# EAGLE design DashHubV6 (EAGLE 9.6.2)
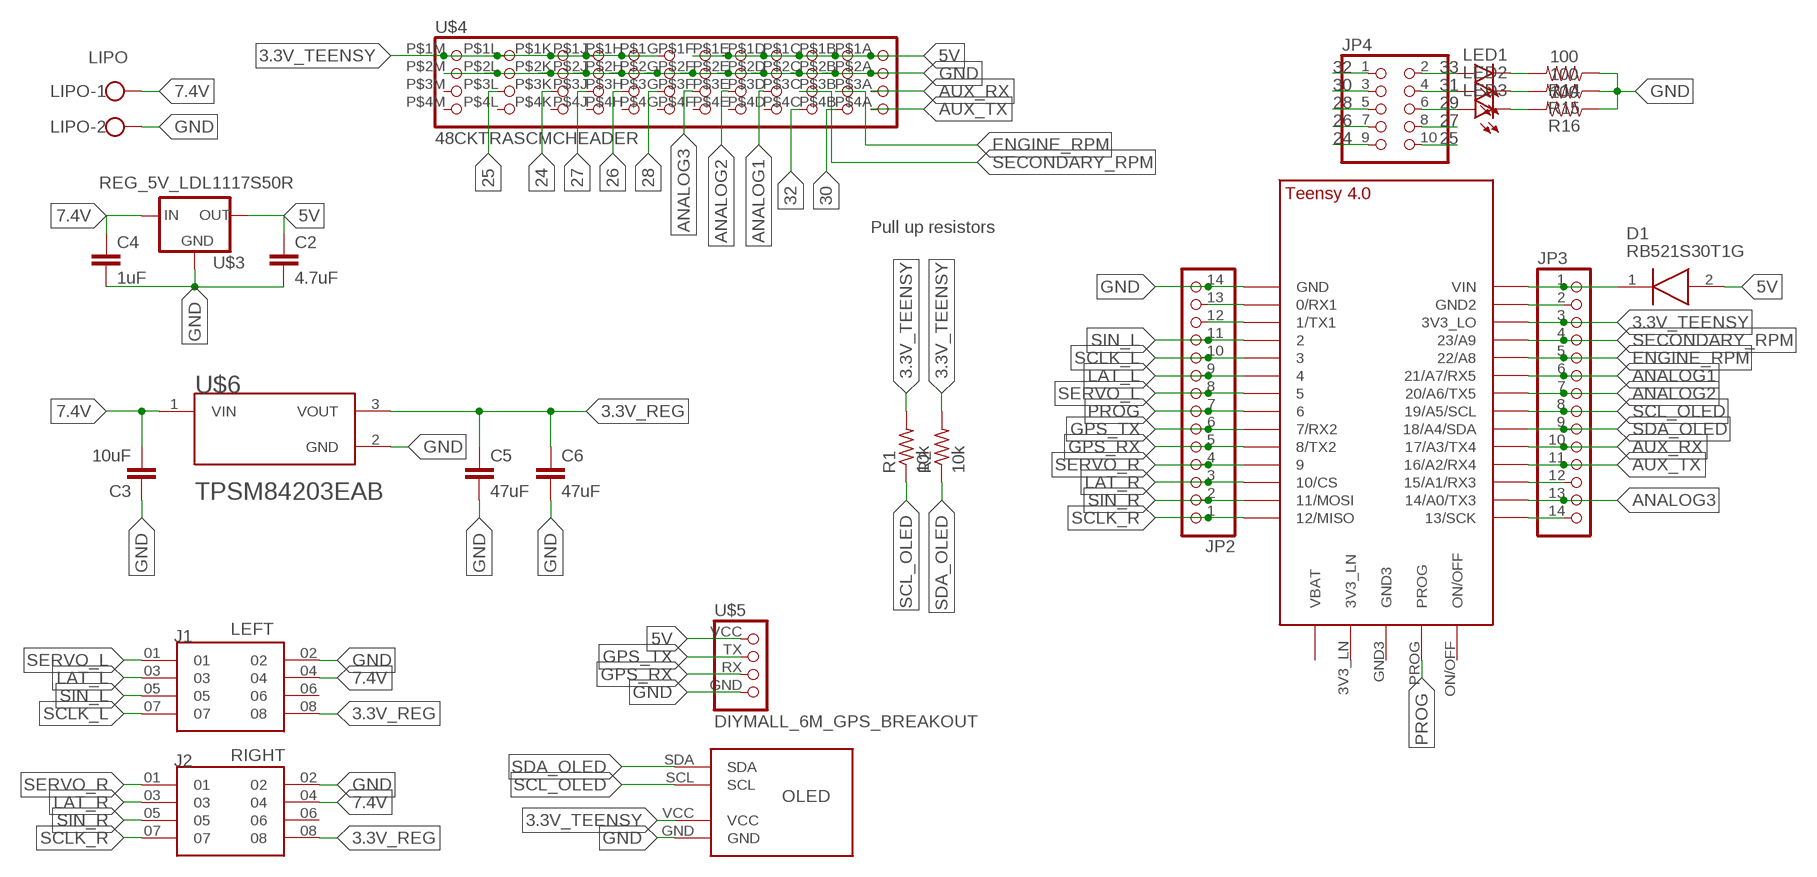
[diagram p0: schematic, sheet 1]

## Parts
C2  4.7uF  CAP_SMDC0603  [C0603]
C3  10uF  CAP_SMDC1206  [C1206]
C4  1uF  CAP_SMDC1206  [C1206]
C5  47uF  CAP_SMDC1206  [C1206]
C6  47uF  CAP_SMDC1206  [C1206]
D1  RB521S30T1G  [SODFL1608X70N]
J1  LEFT  ESW-104-23-L-D  [SAMTEC_ESW-104-23-L-D]
J2  RIGHT  ESW-104-23-L-D  [SAMTEC_ESW-104-23-L-D]
JP2  PINHD-1X14  [1X14]
JP3  PINHD-1X14  [1X14]
JP4  PINHD-2X5  [2X05]
LED1  LEDCHIPLED_1206  [CHIPLED_1206]
LED2  LEDCHIPLED_1206  [CHIPLED_1206]
LED3  LEDCHIPLED_1206  [CHIPLED_1206]
LIPO  LIPO  W237-102  [W237-102]
R1  10k  RES_SMDR0603  [R0603]
R2  10k  RES_SMDR0603  [R0603]
R14  100  RESISTORAXIAL-0.3  [AXIAL-0.3]
R15  100  RESISTORAXIAL-0.3  [AXIAL-0.3]
R16  100  RESISTORAXIAL-0.3  [AXIAL-0.3]
U$1  TEENSY_4.0-BASIC  [TEENSY_4.0-BASIC]
U$2  OLED_SSD1306  [OLED_SSD1306]
U$3  REG_5V_LDL1117S50R  [SOT230P700X180-4N]
U$4  48CKTRASCMCHEADER  [48CKTRASCMCHEADER]
U$5  DIYMALL_6M_GPS_BREAKOUT  [DIYMALL_6M_GPS_BREAKOUT]
U$6  TPSM84205EAB  [TPSM84205EAB]

## Nets
3.3V_REG: C5.1 C6.1 J1.08 J2.08 U$6.3(VOUT)
3.3V_TEENSY: JP3.3 R1.2 R2.2 U$1.3V3_LO U$2.VCC U$4.P$1G(1G) U$4.P$1H(1H) U$4.P$1J(1J) U$4.P$1K(1K) U$4.P$1L(1L) U$4.P$1M(1M)
5V: C2.1 D1.2(A) U$3.2(OUT) U$3.4(OUT) U$4.P$1A(1A) U$4.P$1B(1B) U$4.P$1C(1C) U$4.P$1D(1D) U$4.P$1E(1E) U$4.P$1F(1F) U$5.VCC
7.4V: C3.2 C4.1 J1.04 J2.04 LIPO.1 U$3.3(IN) U$6.1(VIN)
24: JP4.9 U$4.P$3K(3K)
25: JP4.10 U$4.P$3L(3L)
26: JP4.7 U$4.P$3H(3H)
27: JP4.8 U$4.P$3J(3J)
28: JP4.5 U$4.P$3G(3G)
29: JP4.6 LED3.A
30: JP4.3 U$4.P$4B(4B)
31: JP4.4 LED2.A
32: JP4.1 U$4.P$4C(4C)
33: JP4.2 LED1.A
ANALOG1: JP3.6 U$1.21/A7(21/A7/RX5) U$4.P$3D(3D)
ANALOG2: JP3.7 U$1.20/A6(20/A6/TX5) U$4.P$3E(3E)
ANALOG3: JP3.13 U$1.14/A0(14/A0/TX3) U$4.P$3F(3F)
AUX_RX: JP3.10 U$1.17/A3(17/A3/TX4) U$4.P$3A(3A)
AUX_TX: JP3.11 U$1.16/A2(16/A2/RX4) U$4.P$4A(4A)
CURR_SENSE: JP3.12 U$1.15/A1(15/A1/RX3)
ENGINE_RPM: JP3.5 U$1.22/A8 U$4.P$3B(3B)
GND: C2.2 C3.1 C4.2 C5.2 C6.2 J1.02 J2.02 JP2.14 LIPO.2 R14.P$1 R15.P$1 R16.P$1 U$1.GND U$2.GND U$3.1(GND) U$4.P$2A(2A) U$4.P$2B(2B) U$4.P$2C(2C) U$4.P$2D(2D) U$4.P$2E(2E) U$4.P$2F(2F) U$4.P$2G(2G) U$4.P$2H(2H) U$4.P$2J(2J) U$4.P$2K(2K) U$4.P$2L(2L) U$4.P$2M(2M) U$5.GND U$6.2(GND)
GND2: JP3.2 U$1.GND2
GPS_RX: JP2.5 U$1.8(8/TX2) U$5.RX
GPS_TX: JP2.6 U$1.7(7/RX2) U$5.TX
LAT_L: J1.03 JP2.9 U$1.4/CANRX
LAT_R: J2.03 JP2.3 U$1.10/CS
N$2: D1.1(K) JP3.1 U$1.VIN
N$11: LED1.C R14.P$2
N$12: LED2.C R15.P$2
N$13: LED3.C R16.P$2
PROG: JP2.7 U$1.6 U$1.PROG
SCL_OLED: JP3.8 R1.1 U$1.19/A5/SCL U$2.SCL
SCLK_D: JP3.14 U$1.13/SCK
SCLK_L: J1.07 JP2.10 U$1.3/CANTX
SCLK_R: J2.07 JP2.1 U$1.12/MISO
SDA_OLED: JP3.9 R2.1 U$1.18/A4/SDA U$2.SDA
SECONDARY_RPM: JP3.4 U$1.23/A9 U$4.P$3C(3C)
SERVO_L: J1.01 JP2.8 U$1.5
SERVO_R: J2.01 JP2.4 U$1.9/CS
SIN_L: J1.05 JP2.11 U$1.2
SIN_R: J2.05 JP2.2 U$1.11/MOSI
XBEE_RX: JP2.12 U$1.1/TX(1/TX1)
XBEE_TX: JP2.13 U$1.0/RX(0/RX1)
Unconnected: J1.06 J2.06 U$1.3V3_LN U$1.GND3 U$1.ON/OFF U$1.VBAT\(VBAT) U$4.P$3M(3M) U$4.P$4D(4D) U$4.P$4E(4E) U$4.P$4F(4F) U$4.P$4G(4G) U$4.P$4H(4H) U$4.P$4J(4J) U$4.P$4K(4K) U$4.P$4L(4L) U$4.P$4M(4M)

## Notes on the sheet
- Pull up resistors

## Library data of the parts
C2-C6 = GTOR - Passive Components:CAP_SMD: CAPACITOR, European symbol; SPICEPREFIX: C
D1 = RB521S30T1G:RB521S30T1G: Schottky Barrier Diode Source: Datasheet <http://www.onsemi.com/pub/Collateral/RB521S30T1-D.PDF>; ARROW_PART_NUMBER: RB521S30T1G; ARROW_PRICE-STOCK: https://www.arrow.com/en/products/rb521s30t1g/on-semiconductor; DESCRIPTION: Schottky Barrier Diode; HEIGHT: 0.7mm; MANUFACTURER_NAME: ON Semiconductor; MANUFACTURER_PART_NUMBER: RB521S30T1G; MOUSER_PART_NUMBER: 863-RB521S30T1G; MOUSER_PRICE-STOCK: https://www.mouser.co.uk/ProductDetail/ON-Semiconductor/RB521S30T1G?qs=xZq1yRCsb1eKFKS8TVH%2Fqg%3D%3D
J1 J2 = ESW-104-23-L-D:ESW-104-23-L-D; MANUFACTURER: Samtec Inc.; PARTREV: R; STANDARD: Manufacturer Recommendations
JP2 JP3 = pinhead:PINHD-1X14: PIN HEADER
JP4 = pinhead:PINHD-2X5: PIN HEADER
LED1-LED3 = led:LED: LED OSRAM: - CHIPLED LG R971, LG N971, LY N971, LG Q971, LY Q971, LO R971, LY R971 LH N974, LH R974 LS Q976, LO Q976, LY Q976 LO Q996 - Hyper CHIPLED LW Q18S LB Q993, LB Q99A, LB R99A - SideLED LS A670, LO A670, LY A670, LG A670, LP A670 LB A673, LV A673, LT A673, LW A673 LH A674 LY A675 LS A676, LA A676, LO A676, LY A676, LW A676 LS A679, LY A679, LG A679 - Hyper Micro SIDELED® LS Y876, LA Y876, LO Y876, LY Y876 LT Y87S - SmartLED LW L88C, LW L88S LB L89C, LB L89S, LG L890 LS L89K, LO L89K, LY L89K LS L896, LA L896, LO L896, LY L896 - TOPLED LS T670, LO T670, LY T670, LG T670, LP T670 LSG T670, LSP T670, LSY T670, LOP T670, LYG T670 LG T671, LOG T671, LSG T671 LB T673, LV T673, LT T673, LW T673 LH T674 LS T676, LA T676, LO T676, LY T676, LB T676, LH T676, LSB T676, LW T676 LB T67C, LV T67C, LT T67C, LS T67K, LO T67K, LY T67K, LW E67C LS E67B, LA E67B, LO E67B, LY E67B, LB E67C, LV E67C, LT E67C LW T67C LS T679, LY T679, LG T679 LS T770, LO T770, LY T770, LG T770, LP T770 LB T773, LV T773, LT T773, LW T773 LH T774 LS E675, LA E675, LY E675, LS T675 LS T776, LA T776, LO T776, LY T776, LB T776 LHGB T686 LT T68C, LB T68C - Hyper Mini TOPLED® LB M676 - Mini TOPLED Santana® LG M470 LS M47K, LO M47K, LY M47K Source: http://www.osram.convergy.de LUXEON: - LUMILED® LXK2-PW12-R00, LXK2-PW12-S00, LXK2-PW14-U00, LXK2-PW14-V00 LXK2-PM12-R00, LXK2-PM12-S00, LXK2-PM14-U00 LXK2-PE12-Q00, LXK2-PE12-R00, LXK2-PE12-S00, LXK2-PE14-T00, LXK2-PE14-U00 LXK2-PB12-K00, LXK2-PB12-L00, LXK2-PB12-M00, LXK2-PB14-N00, LXK2-PB14-P00, LXK2-PB14-Q00 LXK2-PR12-L00, LXK2-PR12-M00, LXK2-PR14-Q00, LXK2-PR14-R00 LXK2-PD12-Q00, LXK2-PD12-R00, LXK2-PD12-S00 LXK2-PH12-R00, LXK2-PH12-S00 LXK2-PL12-P00, LXK2-PL12-Q00, LXK2-PL12-R00 Source: www.luxeon.com KINGBRIGHT: KA-3528ASYC Source: www.kingbright.com
LIPO = con-wago-500:W237-102: WAGO SCREW CLAMP; MPN: 237-102; OC_FARNELL: unknown; OC_NEWARK: 70K9898
R1 R2 = GTOR - Passive Components:RES_SMD: RESISTOR, American symbol; SPICEPREFIX: R
R14-R16 = SparkFun-Resistors:RESISTOR: Generic Resistor Package
U$1 = Teensy-4.0:TEENSY_4.0-BASIC
U$2 = GTOR - Breakout Boards:OLED_SSD1306
U$3 = GTOR - Active Components:REG_5V_LDL1117S50R
U$4 = GTOR - Connectors:48CKTRASCMCHEADER
U$5 = GTOR - Breakout Boards:DIYMALL_6M_GPS_BREAKOUT
U$6 = GTOR - Active Components:TPSM84205EAB

## Board
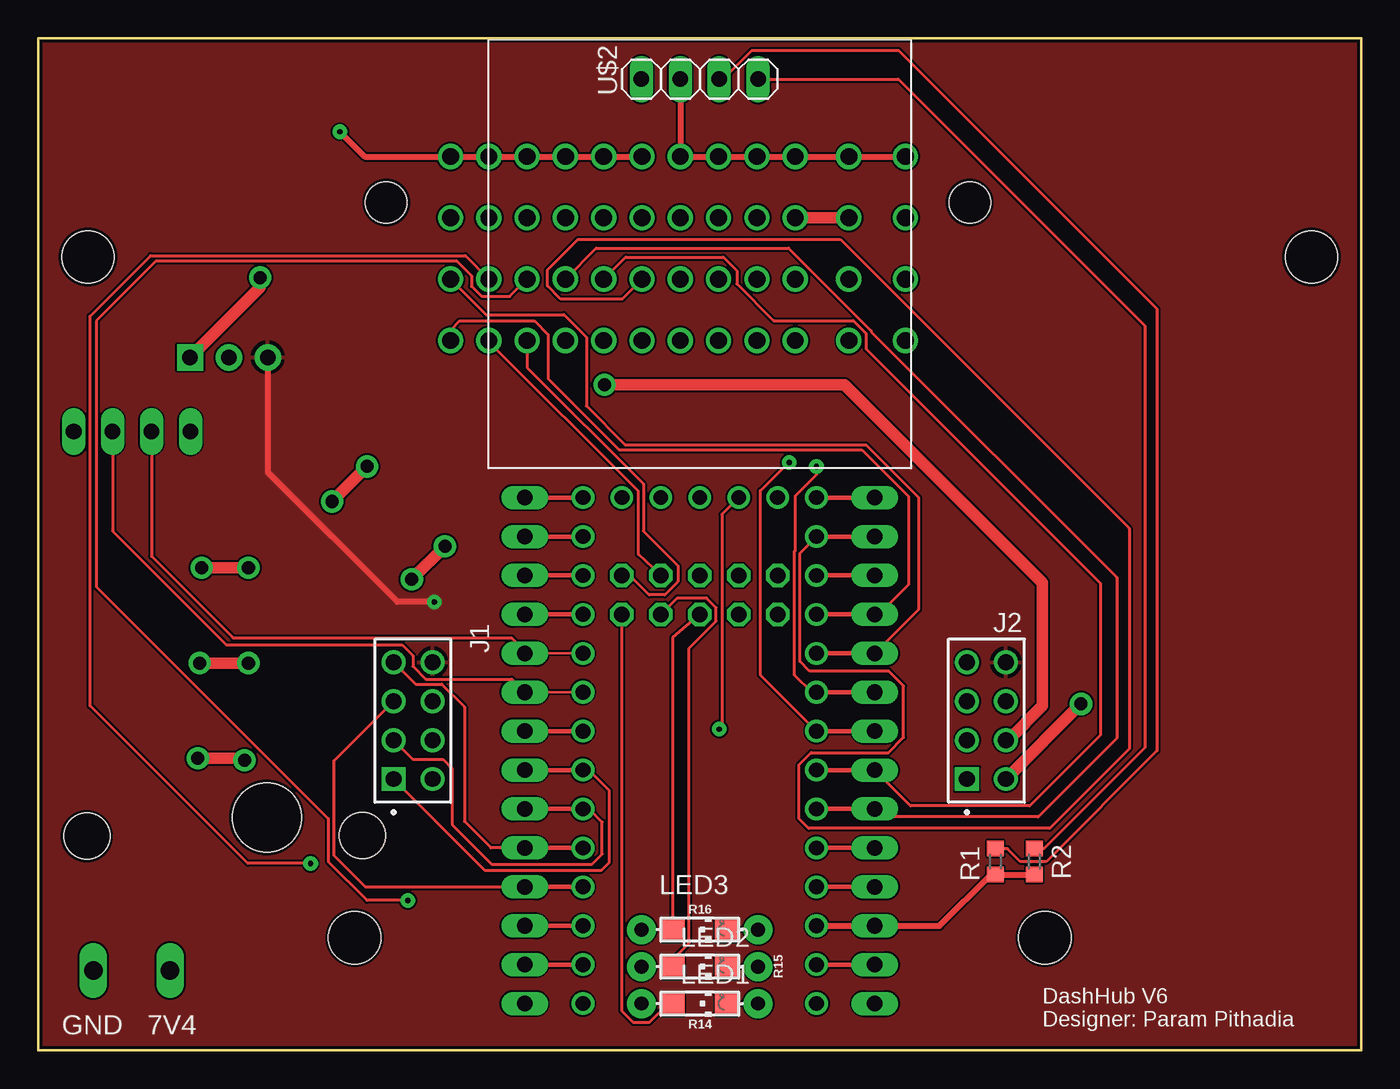
[diagram p1: board, top side]
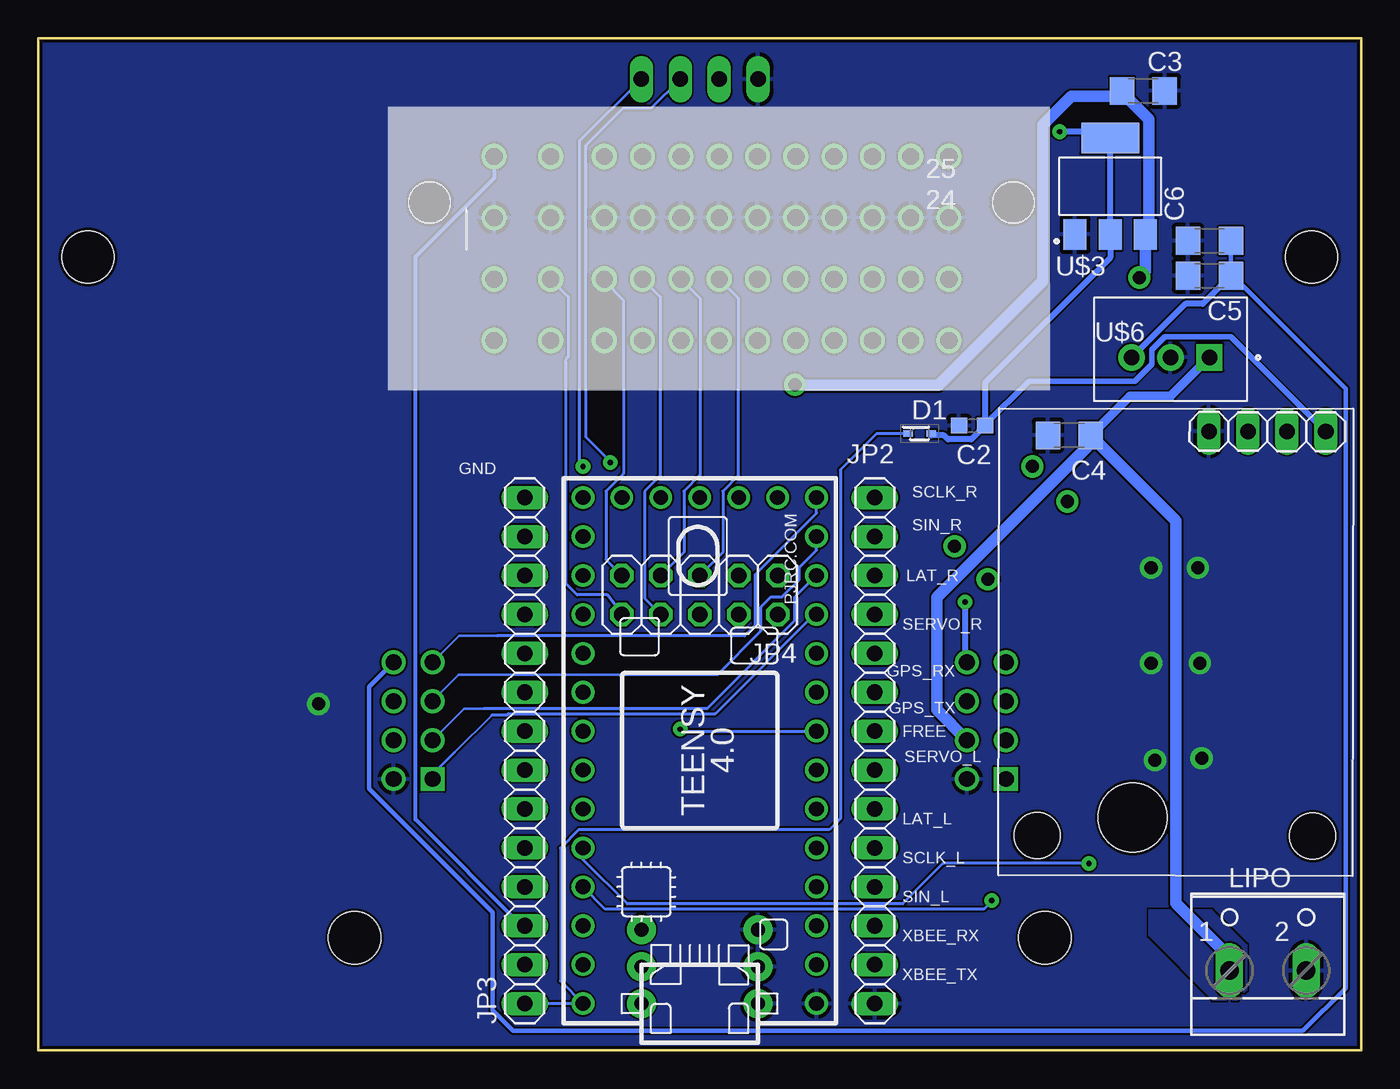
[diagram p2: board, bottom side, seen from below]

Size 86.36 x 66.04 mm. Coordinates in mm from the lower left corner, seen from the top.
Outline: 0,66.04 0,0 86.36,0 86.36,66.04 0,66.04
Copper layers (1*16): Top 0.035mm / dielectric 1.6mm / Bottom 0.035mm
Design rules "designrulecheck_jlcpcb_2layers": minimum track width 5mil, minimum drill 0.3mm, track to track 5mil, track to pad 0.2mm, pad to pad 5mil, via to via 10mil, smd to smd 5mil, copper to edge 0.2mm, drill to drill 0.5mm, minimum pad ring 10mil, minimum via ring 0.3mm, stop-mask expansion 4mil, vias tented up to drill 0mil, thermal gap 10mil
Holes 3.4 mm at 65.71,7.34 83.11,51.77 20.65,7.34 3.25,51.77

### Footprints (pad centres in the part's own frame; a part is rotated, then mirrored left to right if it is on the bottom)
C0603 = smd 1.1 x 1: 1 -0.85,0; 2 0.85,0
C1206 = smd 1.6 x 1.8: 1 -1.4,0; 2 1.4,0
SODFL1608X70N = smd 0.64 x 0.42: 1 -0.75,0; 2 0.75,0
SAMTEC_ESW-104-23-L-D = drill 1.04 pad 1.39 square: 01 0,0 | drill 1.04 pad 1.39: 02 0,2.54; 03 -2.54,0; 04 -2.54,2.54; 05 -5.08,0; 06 -5.08,2.54; 07 -7.62,0; 08 -7.62,2.54
1X14 = drill 1.016 long: 1 -16.51,0; 2 -13.97,0; 3 -11.43,0; 4 -8.89,0; 5 -6.35,0; 6 -3.81,0; 7 -1.27,0; 8 1.27,0; 9 3.81,0; 10 6.35,0; 11 8.89,0; 12 11.43,0; 13 13.97,0; 14 16.51,0
2X05 = drill 1.016 octagon: 1 -5.08,-1.27; 2 -5.08,1.27; 3 -2.54,-1.27; 4 -2.54,1.27; 5 0,-1.27; 6 0,1.27; 7 2.54,-1.27; 8 2.54,1.27; 9 5.08,-1.27; 10 5.08,1.27
CHIPLED_1206 = smd 1.5 x 1.5: A 0,-1.75; C 0,1.75
W237-102 = drill 1.194 long: 1 -2.5,-1.27; 2 2.5,-1.27
R0603 = smd 1 x 1.1: 1 -0.85,0; 2 0.85,0
AXIAL-0.3 = drill 0.9 pad 1.88: P$1 -3.81,0; P$2 3.81,0
TEENSY_4.0-BASIC = drill 0.965: 0/RX -13.97,-7.62; 1/TX -11.43,-7.62; 2 -8.89,-7.62; 3/CANTX -6.35,-7.62; 3V3_LN 16.51,-2.54; 3V3_LO -11.43,7.62; 4/CANRX -3.81,-7.62; 5 -1.27,-7.62; 6 1.27,-7.62; 7 3.81,-7.62; 8 6.35,-7.62; 9/CS 8.89,-7.62; 10/CS 11.43,-7.62; 11/MOSI 13.97,-7.62; 12/MISO 16.51,-7.62; 13/SCK 16.51,7.62; 14/A0 13.97,7.62; 15/A1 11.43,7.62; 16/A2 8.89,7.62; 17/A3 6.35,7.62; 18/A4/SDA 3.81,7.62; 19/A5/SCL 1.27,7.62; 20/A6 -1.27,7.62; 21/A7 -3.81,7.62; 22/A8 -6.35,7.62; 23/A9 -8.89,7.62; GND -16.51,-7.62; GND2 -13.97,7.62; GND3 16.51,0; ON/OFF 16.51,5.08; PROG 16.51,2.54; VBAT\ 16.51,-5.08; VIN -16.51,7.62
OLED_SSD1306 = drill 1.016 long: GND 0,-3.81; SCL 0,1.27; SDA 0,3.81; VCC 0,-1.27
SOT230P700X180-4N = smd 1.5 x 2: 1 -2.3,-3.15; 2 0,-3.15; 3 2.3,-3.15 | smd 3.8 x 2: 4 0,3.15
48CKTRASCMCHEADER = drill 1.1: P$1A 15,6; P$1B 12.5,6; P$1C 10,6; P$1D 7.5,6; P$1E 5,6; P$1F 2.5,6; P$1G 0,6; P$1H -2.5,6; P$1J -5,6; P$1K -7.5,6; P$1L -11,6; P$1M -14.7,6; P$2A 15,2; P$2B 12.5,2; P$2C 10,2; P$2D 7.5,2; P$2E 5,2; P$2F 2.5,2; P$2G 0,2; P$2H -2.5,2; P$2J -5,2; P$2K -7.5,2; P$2L -11,2; P$2M -14.7,2; P$3A 15,-2; P$3B 12.5,-2; P$3C 10,-2; P$3D 7.5,-2; P$3E 5,-2; P$3F 2.5,-2; P$3G 0,-2; P$3H -2.5,-2; P$3J -5,-2; P$3K -7.5,-2; P$3L -11,-2; P$3M -14.7,-2; P$4A 15,-6; P$4B 12.5,-6; P$4C 10,-6; P$4D 7.5,-6; P$4E 5,-6; P$4F 2.5,-6; P$4G 0,-6; P$4H -2.5,-6; P$4J -5,-6; P$4K -7.5,-6; P$4L -11,-6; P$4M -14.7,-6 | hole 2.7: -18.9,3; 19.2,3
DIYMALL_6M_GPS_BREAKOUT = drill 1.016 long: GND 1.5,13.69; RX 1.5,16.23; TX 1.5,18.77; VCC 1.5,21.31 | hole 3: 27.9,2.5; 27.9,20.5 | hole 4.5: 26.7,8.75
TPSM84205EAB = drill 1.01 pad 1.71 square: 1 -2.54,0 | drill 1.01 pad 1.71: 2 0,0; 3 2.54,0

### Placement (x,y rotation side)
C2  25.4,40.77 180 bottom
C3  14.22,62.61 180 bottom
C4  19.05,40.13 180 bottom
C5  9.91,50.55 180 bottom
C6  9.91,52.83 180 bottom
D1  28.83,40.26 0 bottom
J1  23.19,17.7 270 top
J2  60.63,17.7 270 top
JP2  31.75,19.56 270 bottom
JP3  54.61,19.56 90 bottom
JP4  43.18,29.72 180 bottom
LED1  43.18,3.05 270 top
LED2  43.18,5.46 270 top
LED3  43.18,7.87 270 top
LIPO  6.1,6.48 0 bottom
R1  62.48,12.32 270 top
R2  65.02,12.32 270 top
R14  43.18,3.05 0 top
R15  43.18,5.46 0 top
R16  43.18,7.87 0 top
U$1  43.18,19.56 90 bottom
U$2  43.18,63.37 270 top
U$3  16.38,56.39 0 bottom
U$4  41.91,52.32 0 bottom
U$5  23.62,41.91 269.9 bottom
U$6  12.45,45.21 180 bottom

### Tracks (layer width: path | path; a pad name or v marks a point on that pad's centre or on a via)
3.3V_REG  (via drill 0.35)
  Top 0.406: U$6.3 14.99,37.72 23.45,29.26 v25.86,29.26
  Bottom 0.279: C6.1 C5.1
  Bottom 0.305: 8.39,50.55 1.02,43.18 1.02,4.06 3.81,1.27 55.37,1.27 56.72,2.62 56.72,9 64.77,17.05 64.77,23.72 J2.08
  Bottom 0.406: v25.86,29.26 25.86,25.46 J1.08 | 8.39,50.55 C5.1 10.35,48.7 11.5,48.7 U$6.3
  pour Top: 101.35,73.03 101.35,-0.63 -9.09,-0.63 -18.23,8.51 -18.23,73.84 -15.88,76.2 98.17,76.2
3.3V_TEENSY
  Top 0.406: U$4.P$1M U$4.P$1L U$4.P$1K U$4.P$1J U$4.P$1H U$4.P$1G U$2.VCC | U$1.3V3_LO JP3.3 58.83,8.13 62.17,11.47 R1.2 R2.2
  Bottom 0.254: JP3.3 54.8,8.13 61.74,15.07 61.74,51.77 56.59,56.92 56.59,58.31 U$4.P$1M
5V  (via drill 0.35)
  Top 0.406: v19.68,59.94 21.3,58.32 U$4.P$1A U$4.P$1B U$4.P$1C U$4.P$1D U$4.P$1E U$4.P$1F
  Bottom 0.356: U$5.VCC 8.51,46.57 12.83,46.57 13.68,45.72 13.68,44.78 14.79,43.66 21.69,43.66 24.55,40.81 C2.1
  Bottom 0.406: D1.2 28.08,40.13 27.23,40.13 26.97,39.86 25.45,39.86 C2.1 24.55,43.56 16.38,51.73 U$3.2 U$3.4 16.79,59.94 v19.68,59.94
7.4V  (via drill 0.85)
  Top 0.762: v14.48,50.43 14.48,49.78 U$6.1 | J2.04 63.32,20.24 65.55,22.47 65.55,30.52 52.63,43.43 v36.96,43.43
  Bottom 0.61: U$6.1 12.45,42.67 15.11,42.67 C4.1
  Bottom 0.762: v14.48,50.43 14.08,50.83 U$3.3 13.85,53.47 13.85,60.75 15.62,62.52 C3.2 15.97,62.26 18.94,62.26 20.79,60.4 20.79,59.48 20.78,59.47 20.78,50.21 27.6,43.39 36.92,43.39 v36.96,43.43 | J1.04 27.71,22.23 27.71,29.56 17.65,39.62 C4.1 17.65,40.11 12.09,34.54 12.09,12.19 12.09,9.59 8.6,6.1 LIPO.1
24
  Bottom 0.203: JP4.9 49.3,32.03 49.3,36.5 48.16,37.64 48.16,48.95 49.41,50.2 U$4.P$3K
25
  Bottom 0.203: JP4.10 49.21,29.72 51.18,29.72 51.92,30.46 51.92,45.09 51.77,45.24 51.77,49.18 U$4.P$3L
26
  Bottom 0.203: U$4.P$3H 43.16,49.07 43.16,37.56 44.22,36.5 44.22,32.49 JP4.7
27
  Bottom 0.203: U$4.P$3J 45.77,49.18 45.77,37.49 46.78,36.47 46.78,29.51 JP4.8
28
  Bottom 0.203: U$4.P$3G 40.69,49.11 40.69,37.48 41.68,36.5 41.68,32.49 JP4.5
29
  Top 0.203: LED3.A 41.43,26.95 JP4.6
30
  Top 0.203: JP4.3 39.17,32.36 39.17,36.49 29.41,46.25 U$4.P$4B
31
  Top 0.203: JP4.4 41.7,29.51 43.62,29.51 44.24,28.89 44.24,28.01 42.48,26.25 42.48,7 41.43,5.95 LED2.A
32
  Top 0.203: JP4.1 38.61,30.99 39.88,29.72 40.9,29.72 41.76,30.58 41.76,31.62 39.5,33.88 39.5,36.96 31.91,44.54 U$4.P$4C
33
  Top 0.203: JP4.2 38.1,2.56 38.86,1.81 39.88,1.81 41.13,3.05 LED1.A
ANALOG1
  Top 0.203: JP3.6 55.12,15.24 65.28,15.24 70.4,20.36 70.4,30.87 54.37,46.9 54.37,46.96 48.98,52.34 36.42,52.34 U$4.P$3D
  Top 0.305: JP3.6 U$1.21/A7
ANALOG2
  Top 0.203: JP3.7 56.94,15.96 64.73,15.96 69.34,20.57 69.34,30.47 54.04,45.78 54.04,46.79 53.21,47.62 48,47.62 45.6,50.02 45.6,50.88 44.72,51.76 38.34,51.76 U$4.P$3E
  Top 0.305: JP3.7 U$1.20/A6
ANALOG3
  Top 0.203: U$1.14/A0 49.71,32.44 49.71,25.38 50.35,24.74 55.53,24.74 56.49,23.78 56.49,20.42 55.5,19.43 50.45,19.43 49.66,18.64 49.66,15.11 50.29,14.48 66.03,14.48 71.22,19.67 71.22,34.07 52.36,52.93 35.23,52.93 33.23,50.93 33.23,49.89 34.1,49.02 38.11,49.02 U$4.P$3F
  Top 0.305: JP3.13 U$1.14/A0
AUX_RX
  Top 0.203: JP3.10 57.46,28.76 57.46,36.09 54.04,39.52 38.31,39.52 35.78,42.05 35.78,46.54 34.32,48.01 29.23,48.01 U$4.P$3A
  Top 0.305: JP3.10 U$1.17/A3
AUX_TX
  Top 0.203: U$4.P$4A 26.91,46.99 27.51,47.59 32.38,47.59 33.28,46.7 33.28,43.83 37.92,39.19 53.76,39.19 56.8,36.14 56.8,30.39 54.86,28.45 JP3.11
  Top 0.305: JP3.11 U$1.16/A2
CURR_SENSE
  Top 0.305: JP3.12 U$1.15/A1
ENGINE_RPM  (via drill 0.35)
  Top 0.203: v17.78,12.19 13.67,12.19 3.38,22.48 3.38,47.91 7.33,51.85 27.88,51.85 U$4.P$3B
  Top 0.305: JP3.5 U$1.22/A8
  Bottom 0.203: U$1.22/A8 50.8,12.45 47.9,9.55 29.95,9.55 27.31,12.19 v17.78,12.19
GND  (via drill 0.85)
  Top 0.762: v10.67,31.5 v13.72,31.5 | v10.54,25.27 v13.72,25.27 | v10.41,19.05 13.34,19.05 v13.46,18.92 | J2.02 v68.07,22.61 | U$4.P$2L U$4.P$2K
  pour Bottom (rank 5): -13.45,71.77 -13.45,5.33 -7.1,-1.02 99.06,-1.02 99.06,72.14 98.42,72.77 -12.45,72.77
GND1  (via drill 0.85)
  Top 0.762: v21.46,38.1 v19.18,35.81
GND2
  Top 0.305: JP3.2 U$1.GND2
GND3  (via drill 0.85)
  Top 0.762: v24.38,30.73 v26.54,32.89
GPS_RX
  Top 0.152: U$1.8 JP2.5
  Top 0.203: U$5.RX 7.4,32.23 12.71,26.92 30.9,26.92 31.75,26.06 JP2.5
GPS_TX
  Top 0.152: U$1.7 JP2.6
  Top 0.203: U$5.TX 4.85,33.88 12.28,26.46 23.73,26.46 24.45,25.74 24.45,25.05 25.28,24.22 30.92,24.22 31.75,23.39 JP2.6
LAT_L
  Top 0.203: J1.03 24.44,18.99 26.41,18.99 27.02,18.39 27.02,14.73 29.6,12.14 36.15,12.14 36.8,12.8 36.8,14.89 35.95,15.75 U$1.4/CANRX
  Top 0.305: JP2.9 U$1.4/CANRX
LAT_R
  Top 0.305: JP2.3 U$1.10/CS
  Bottom 0.178: J2.03 58.57,22.3 57.28,22.3
  Bottom 0.203: 57.28,22.3 42.72,22.3 36.96,28.07 36.96,29.59 U$1.10/CS
LIPO_IN
  pour Bottom (no thermals): 13.84,9.14 13.84,7.49 9.65,3.3 8.13,3.3 7.49,3.94 7.49,6.86 9.78,9.14
N$2
  Bottom 0.203: JP3.1 U$1.VIN 52.28,4.52 52.28,13.2 51.08,14.4 34.72,14.4 34.01,15.11 34.01,37.87 31.62,40.26 D1.1
N$11
  Top 0.203: R14.P$2 LED1.C
N$12
  Top 0.203: R15.P$2 LED2.C
N$13
  Top 0.203: R16.P$2 LED3.C
PROG  (via drill 0.35)
  Top 0.203: v44.45,20.96 44.62,21.13 44.62,34.97 U$1.PROG
  Top 0.305: JP2.7 U$1.6
  Bottom 0.203: U$1.6 44.32,20.83 v44.45,20.96
SCL_OLED  (via drill 0.35)
  Top 0.203: U$1.19/A5/SCL 47.14,24.49 47.14,36.53 48.97,38.35 v49.02,38.35 | U$2.SCL 44.7,63.37 46.58,65.25 56.16,65.25 73.03,48.39 73.03,19.54 65.8,12.31 64.12,12.31 63.27,13.17 R1.1
  Top 0.305: U$1.19/A5/SCL JP3.8
  Bottom 0.203: v49.02,38.35 49.02,38.43 50.59,40 50.59,59.06 48.15,61.49 46.33,61.49 U$2.SCL
SCLK_D
  Top 0.305: U$1.13/SCK JP3.14
SCLK_L
  Top 0.203: J1.07 24.62,23.89 26.34,23.89 27.81,22.42 27.81,14.95 29.55,13.21 JP2.10
  Top 0.305: JP2.10 U$1.3/CANTX
SCLK_R
  Top 0.305: U$1.12/MISO JP2.1
  Bottom 0.178: J2.07 58.9,27.05 56.39,27.05
  Bottom 0.203: U$1.12/MISO 35.56,35.06 39.57,31.04 39.57,27.74 40.26,27.05 56.39,27.05
SDA_OLED  (via drill 0.35)
  Top 0.203: U$1.18/A4/SDA 50.49,23.37 49.38,24.48 49.38,32.57 49.4,32.6 49.4,36.16 50.8,37.56 v50.8,38.1 | U$2.SDA 56.13,63.37 72.22,47.28 72.22,19.73 65.66,13.17 R2.1
  Top 0.305: JP3.9 U$1.18/A4/SDA
  Bottom 0.203: v50.8,38.1 51.05,38.35 51.05,59.32 U$2.SDA
SECONDARY_RPM  (via drill 0.35)
  Top 0.203: v24.13,9.78 21.46,9.78 18.92,12.32 18.92,15.11 3.79,30.25 3.79,47.6 7.7,51.51 27.32,51.51 28.28,50.54 28.28,49.86 28.94,49.2 30.77,49.2 31.89,50.32 U$4.P$3C
  Top 0.305: JP3.4 U$1.23/A9
  Bottom 0.203: U$1.23/A9 49.35,9.22 24.64,9.22 24.13,9.73 v24.13,9.78
SERVO_L
  Top 0.203: J1.01 29.14,11.75 36.77,11.75 37.29,12.27 37.29,16.95 35.95,18.29 U$1.5
  Top 0.305: JP2.8 U$1.5
SERVO_R
  Top 0.305: JP2.4 U$1.9/CS
  Bottom 0.178: 56.75,21.88 59.19,19.44
  Bottom 0.203: J2.01 60.63,18 59.19,19.44 | U$1.9/CS 35.69,28.45 42.17,21.97 55.67,21.97 55.76,21.88 56.75,21.88
SIN_L
  Top 0.203: JP2.11 21.34,10.67 19.3,12.7 19.3,18.9 J1.05
  Top 0.305: JP2.11 U$1.2
SIN_R
  Top 0.305: JP2.2 U$1.11/MOSI
  Bottom 0.178: 42.04,24.51 58.93,24.51 60.63,22.81 J2.05
  Bottom 0.203: U$1.11/MOSI 35.56,32.64 36.68,31.53 36.68,30.72 37.81,29.59 38.52,29.59 39.17,28.95 39.17,27.38 42.04,24.51
XBEE_RX
  Top 0.305: JP2.12 U$1.1/TX
XBEE_TX
  Top 0.305: JP2.13 U$1.0/RX

### Text on the board
tPlace: DashHub V6 / Designer: Param Pithadia | GND | 7V4
bPlace: 25 | 24 | GND | SCLK_R | SIN_R | LAT_R | SERVO_R | GPS_RX | GPS_TX | FREE | SERVO_L | LAT_L | SCLK_L | SIN_L | XBEE_RX | XBEE_TX